# Altium schematic sheet Relay.SchDoc
size A4; SheetNumber: 5; SheetTotal: 5
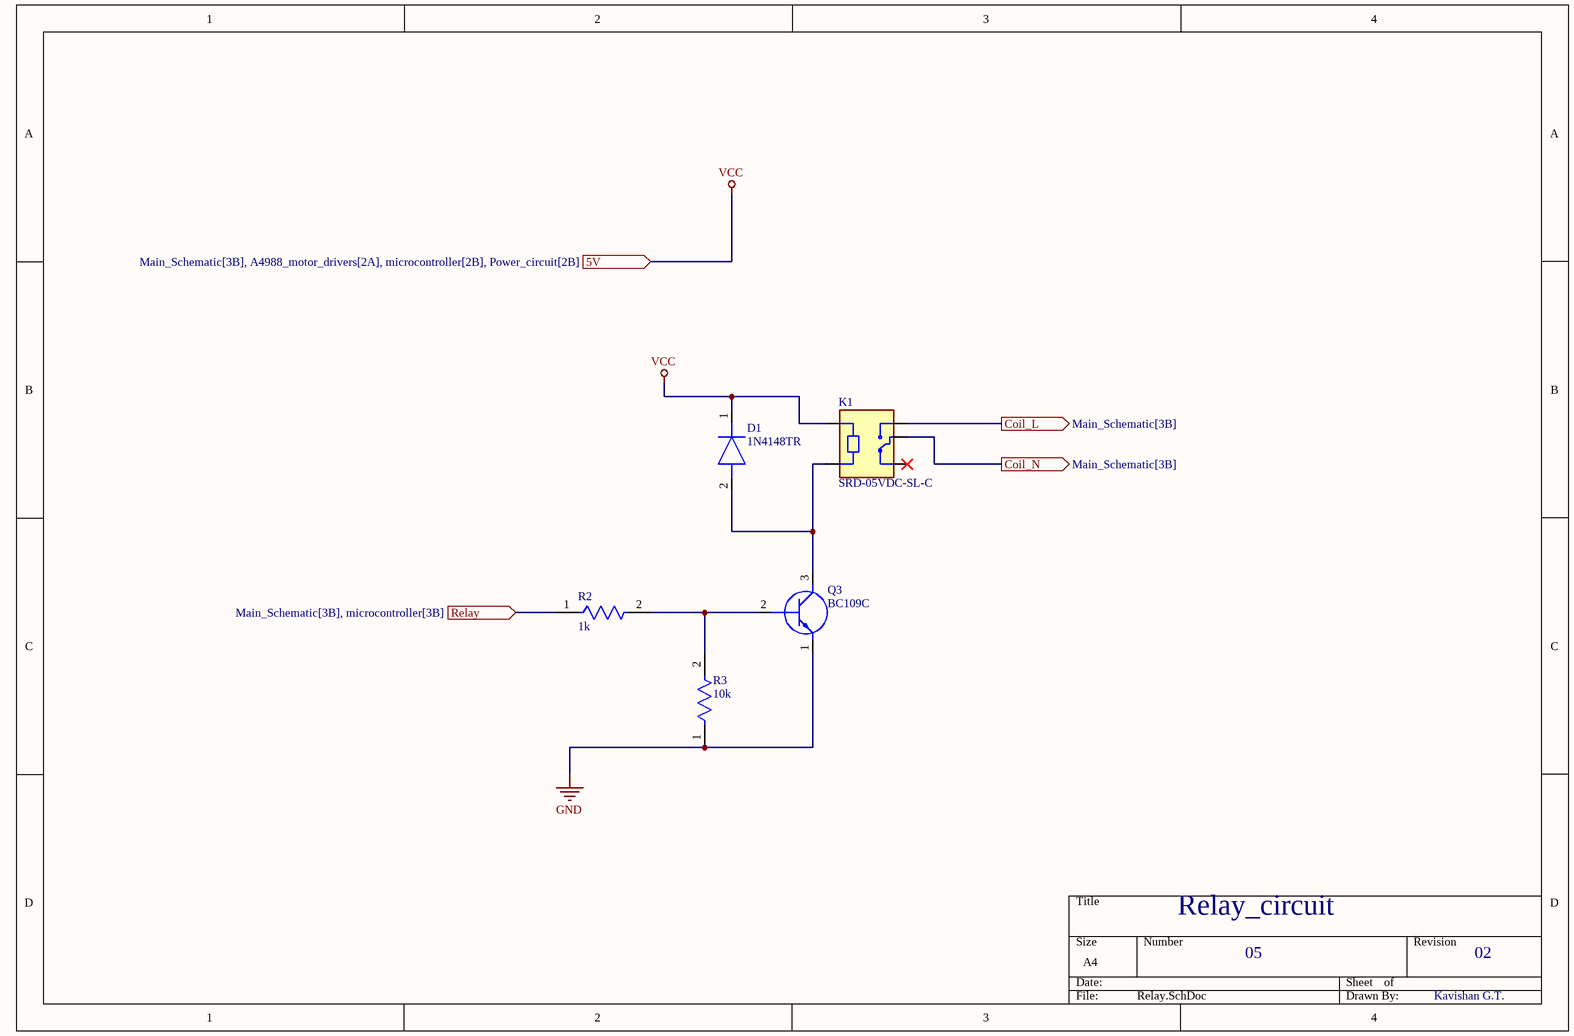
[diagram p0: Relay.SchDoc]

## Parts
D1  1N4148TR  [DIOAD990W55L340D162]
K1  SRD-05VDC-SL-C  [RELAY_SRD-05VDC-SL-C]
Q3  BC109C  [CENTRAL_TO18]
R2  1k  [FP-MFR-25-MFG]
R3  10k  [FP-MFR-25-MFG]

## Ports
5V (in, see Main_Schematic[3B], A4988_motor_drivers[2A], microcontroller[2B], Power_circuit[2B]), Coil_L (out, see Main_Schematic[3B]), Coil_N (out, see Main_Schematic[3B]), Relay (in, see Main_Schematic[3B], microcontroller[3B])

## Nets
GND: Q3.1(E) R3.1
VCC: D1.1(K) K1.A1 ; port 5V
Coil_L: K1.NO ; port Coil_L
Coil_N: K1.COM ; port Coil_N
Relay: R2.1 ; port Relay
NetD1_2: D1.2(A) K1.A2 Q3.3(C)
NetQ3_2: Q3.2(B) R2.2 R3.2

Not connected (* = marked no-connect by the designer): K1 NC*

## Notes on the sheet
- Relay_circuit
- 05
- 02
- Kavishan G.T.

## Library data of the parts
D1 = 1N4148TR: Diode; Manufacturer_Name: Vishay; Datasheet Link: https://www.vishay.com/docs/81857/1n4148.pdf; Manufacturer_Part_Number: 1N4148TR; Mouser Part Number: 78-1N4148; Mouser Price/Stock: https://www.mouser.co.uk/ProductDetail/Vishay-Semiconductors/1N4148TR?qs=HfDODkYFUverVKi%2FJ%2Fe5IA%3D%3D; Arrow Part Number: 1N4148TR; Arrow Price/Stock: https://www.arrow.com/en/products/1n4148tr/vishay?region=nac
K1 = SRD-05VDC-SL-C: 5V Trigger Relay Module For Arduino And Raspberry Pi 5V Trigger Relay Module For Arduino And Raspberry Pi; MF: Songle Relay; Check_prices: https://www.snapeda.com/parts/SRD-05VDC-SL-C/Songle+Relay/view-part/?ref=eda; Value: *; Availability: Not in stock; Price: None; Package: NON STANDARD-5 Songle Relay; MP: SRD-05VDC-SL-C; SnapEDA_Link: https://www.snapeda.com/parts/SRD-05VDC-SL-C/Songle+Relay/view-part/?ref=snap
Q3 = BC109C: Transistor BJT NPN; Manufacturer_Name: Central Semiconductor; Datasheet Link: https://my.centralsemi.com/get_document.php?cmp=1&mergetype=pd&mergepath=pd&pdf_id=BC107.PDF; Manufacturer_Part_Number: BC109C; Mouser Part Number: 610-BC109C; Mouser Price/Stock: https://www.mouser.com/Search/Refine.aspx?Keyword=610-BC109C
R2 R3 = CMP-03413-000001-1: RES 1.18K OHM 1/4W 1% AXIAL; Manufacturer: Yageo; Manufacturer Part Number: MFR-25FBF52-1K18; Value: 1.18kΩ; Temperature Coefficient: 100ppm/°C; Power Rating: 0.25W; Voltage Rating: 250V; Temperature: -55°C to +155°C; Automotive: No; Temperature Range High: +155°C; Mouser Description: Metal Film Resistors 1.18K OHM 1/4W 1%; Digikey Description: RES 1.18K OHM 1/4W 1% AXIAL; Lead Free: Yes; Tolerance: 1%; ComponentLink2Description: Datasheet; ComponentLink2URL: https://www.yageo.com/upload/media/product/products/datasheet/lr/Yageo_LR_MFR_1.pdf; Temperature Range Low: -55°C; Package: MFR-25; Ipc Land Pattern Name: RESAD1000W75L680D260; Composition: Metal Film; Category: Res; Octopart: https://octopart.com/mfr-25fbf52-1k18-yageo-56251681; Series: MFR; Device Class L2: Resistors; Height: 2.6mm; Resistance: 1.18kΩ; Device Class L3: Through-Hole Resistors; RoHS: TRUE; Device Class L1: Passive Components